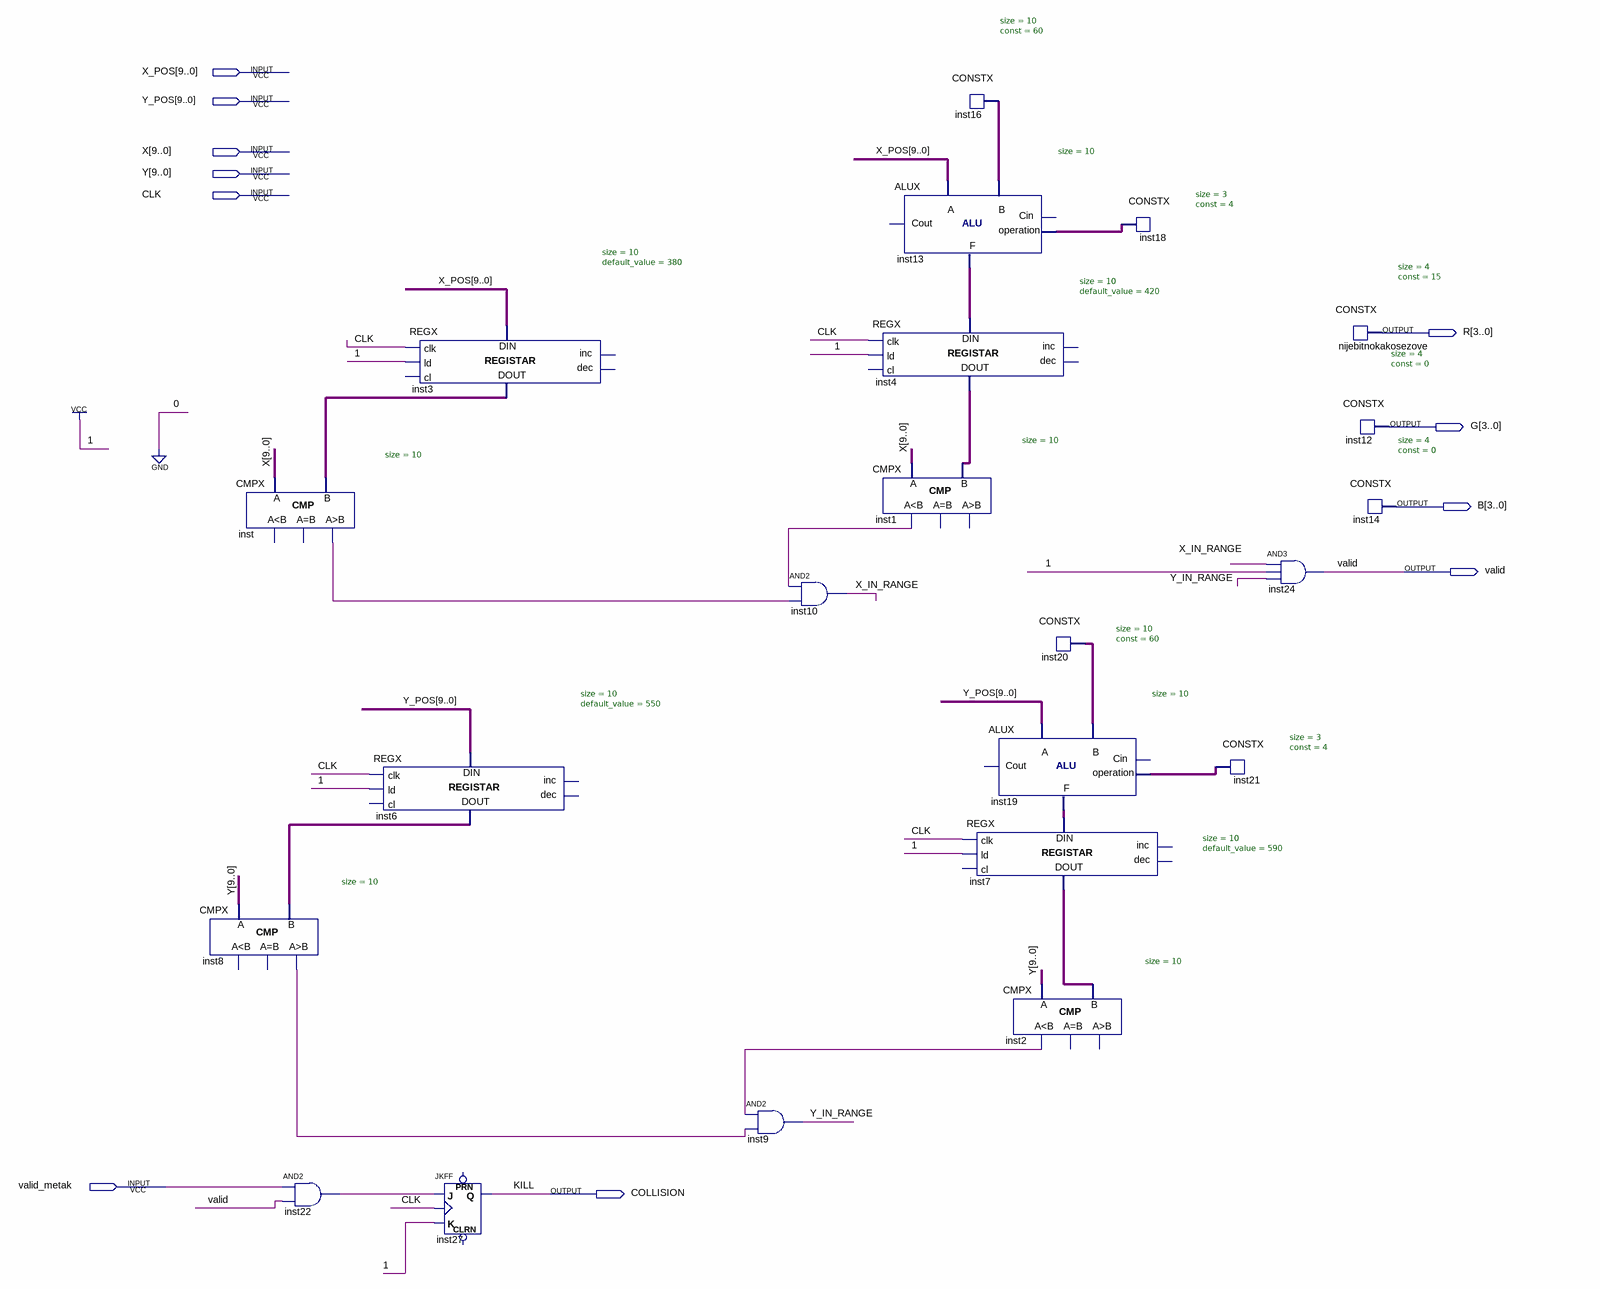
[diagram p0: schematic sheet]
// Quartus schematic Koka.bdf as structural Verilog: 22 symbols, 11 pins
module Koka (
  input  [9:0] X_POS,
  input  [9:0] Y_POS,
  input  [9:0] X,
  input  [9:0] Y,
  input  CLK,
  input  valid_metak,
  output [3:0] R,
  output [3:0] G,
  output [3:0] B,
  output valid,
  output COLLISION
);

  wire inst1_ls, inst2_ls, inst8_gr, inst22_out, inst_gr, X_IN_RANGE, Y_IN_RANGE;
  wire [2:0] inst18_data, inst21_data;
  wire [9:0] inst3_data_out, inst4_data_out, inst6_data_out, inst7_data_out, inst13_f, inst16_data, inst19_f,
       inst20_data;

  CMPX #(.size(10)) inst (.A(X), .B(inst3_data_out), .gr(inst_gr));  // open: ls, eq
  CMPX #(.size(10)) inst8 (.A(Y), .B(inst6_data_out), .gr(inst8_gr));  // open: ls, eq
  and inst22 (inst22_out, valid_metak, valid);
  REGX #(.size(10), .default_value(380)) inst3 (
    .clk(CLK), .ld(1'b1), .data_in(X_POS), .data_out(inst3_data_out));  // open: cl, inc, dec
  REGX #(.size(10), .default_value(550)) inst6 (
    .clk(CLK), .ld(1'b1), .data_in(Y_POS), .data_out(inst6_data_out));  // open: cl, inc, dec
  JKFF inst27 (.K(1'b1), .J(inst22_out), .CLK(CLK), .Q(COLLISION));  // open: PRN, CLRN
  and inst9 (Y_IN_RANGE, inst2_ls, inst8_gr);
  and inst10 (X_IN_RANGE, inst1_ls, inst_gr);
  REGX #(.size(10), .default_value(420)) inst4 (
    .clk(CLK), .ld(1'b1), .data_in(inst13_f), .data_out(inst4_data_out));  // open: cl, inc, dec
  CMPX #(.size(10)) inst1 (.A(X), .B(inst4_data_out), .ls(inst1_ls));  // open: eq, gr
  ALUX #(.size(10)) inst13 (.B(inst16_data), .A(X_POS), .op(inst18_data), .F(inst13_f));  // open: Cin, Cout
  CONSTX #(.size(10), .\const (60)) inst16 (.data(inst16_data));
  ALUX #(.size(10)) inst19 (.B(inst20_data), .A(Y_POS), .op(inst21_data), .F(inst19_f));  // open: Cin, Cout
  REGX #(.size(10), .default_value(590)) inst7 (
    .clk(CLK), .ld(1'b1), .data_in(inst19_f), .data_out(inst7_data_out));  // open: cl, inc, dec
  CONSTX #(.size(10), .\const (60)) inst20 (.data(inst20_data));
  CMPX #(.size(10)) inst2 (.A(Y), .B(inst7_data_out), .ls(inst2_ls));  // open: eq, gr
  CONSTX #(.size(3), .\const (4)) inst18 (.data(inst18_data));
  CONSTX #(.size(3), .\const (4)) inst21 (.data(inst21_data));
  and inst24 (valid, X_IN_RANGE, 1'b1, Y_IN_RANGE);
  CONSTX #(.size(4), .\const (15)) nijebitnokakosezove (.data(R));
  CONSTX #(.size(4), .\const (0)) inst12 (.data(G));
  CONSTX #(.size(4), .\const (0)) inst14 (.data(B));

  // Other names for the same wires on the sheet: KILL = COLLISION
endmodule
